# EAGLE design Bike_Seat_Light (EAGLE 7.2.0)
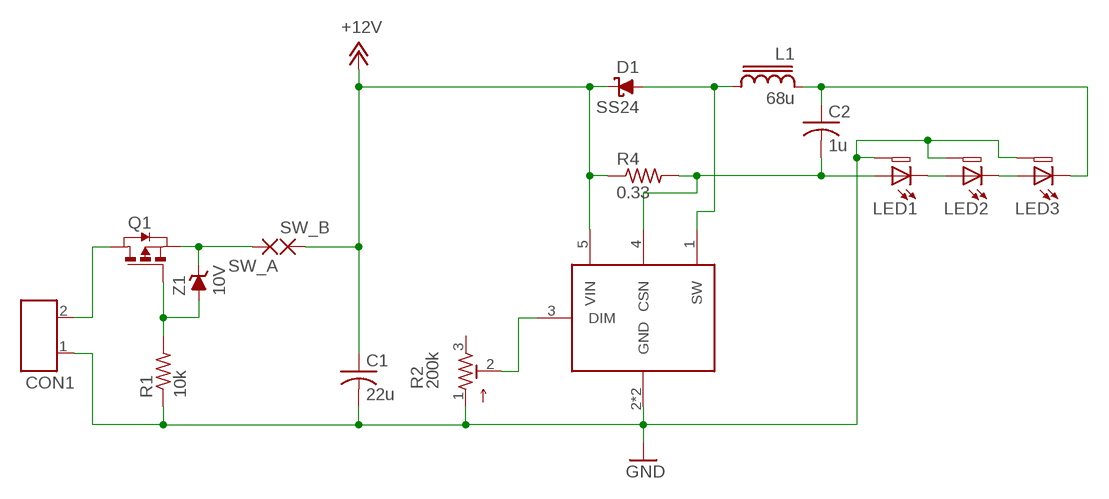
[diagram p0: schematic, sheet 1]

## Parts
C1  22u  C-USC1210K  [C1210K]
C2  1u  C-USC0805K  [C0805K]
CON1  KF128H  [KF128H]
D1  SS24  SCHOTTKYSCHOTTKY-DO214AC  [DO214AC]
IC1  PT4115  [SOT-89-5]
L1  68u  CDRH127/LD  [CDRH127/LD]
LED1  POWER_LED  [POWER_LED]
LED2  POWER_LED  [POWER_LED]
LED3  POWER_LED  [POWER_LED]
Q1  PMOSSOT23  [SOT-23]
R1  10k  R-US_R0805  [R0805]
R2  200k  TRIM_US-3306F  [3306F]
R4  0.33  R-US_R2512  [R2512]
SW_A  1,6/0,9  [1,6/0,9]
SW_B  1,6/0,9  [1,6/0,9]
Z1  10V  ZENER  [SOD123]

## Nets
+12V: C1.1 D1.C IC1.5(VIN) R4.1 SW_B.1(P)
GND: C1.2 CON1.1 IC1.2(GND) IC1.EX(GND) LED1.T LED2.T LED3.T R1.1 R2.1
N$1: C2.2 IC1.4(CSN) LED1.1(A) R4.2
N$2: IC1.3(DIM) R2.2
N$3: Q1.2(S) SW_A.1(P) Z1.C
N$4: D1.A IC1.1(SW) L1.2
N$6: LED1.2(C) LED2.1(A)
N$7: LED2.2(C) LED3.1(A)
N$8: Q1.3(G) R1.2 Z1.A
N$10: C2.1 L1.1 LED3.2(C)
N$17: CON1.2 Q1.1(D)
Unconnected: R2.3

## Library data of the parts
C1 C2 = resistor:C-US: CAPACITOR, American symbol
CON1 = Connector:KF128H
D1 = diode:SCHOTTKY
IC1 = IC:PT4115
L1 = Inductor:CDRH127/LD
LED1-LED3 = LED:POWER_LED
Q1 = zetex:PMOSSOT23: MOS FET; OC_FARNELL: unknown; OC_NEWARK: unknown
R1 R4 = resistor:R-US_: RESISTOR, American symbol
R2 = pot:TRIM_US-: POTENTIOMETER
SW_A SW_B = wirepad:1,6/0,9: THROUGH-HOLE PAD
Z1 = diode:ZENER

## Board
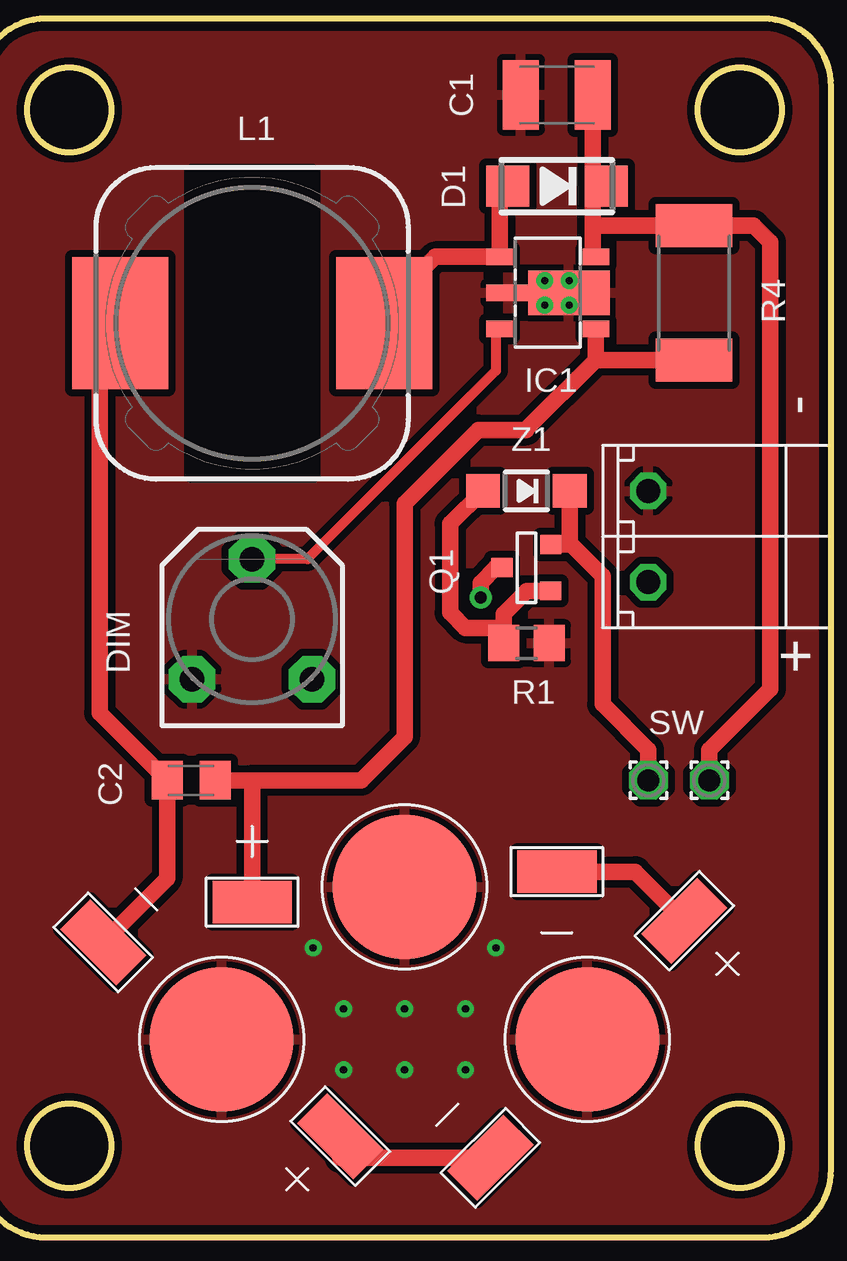
[diagram p1: board, top side]
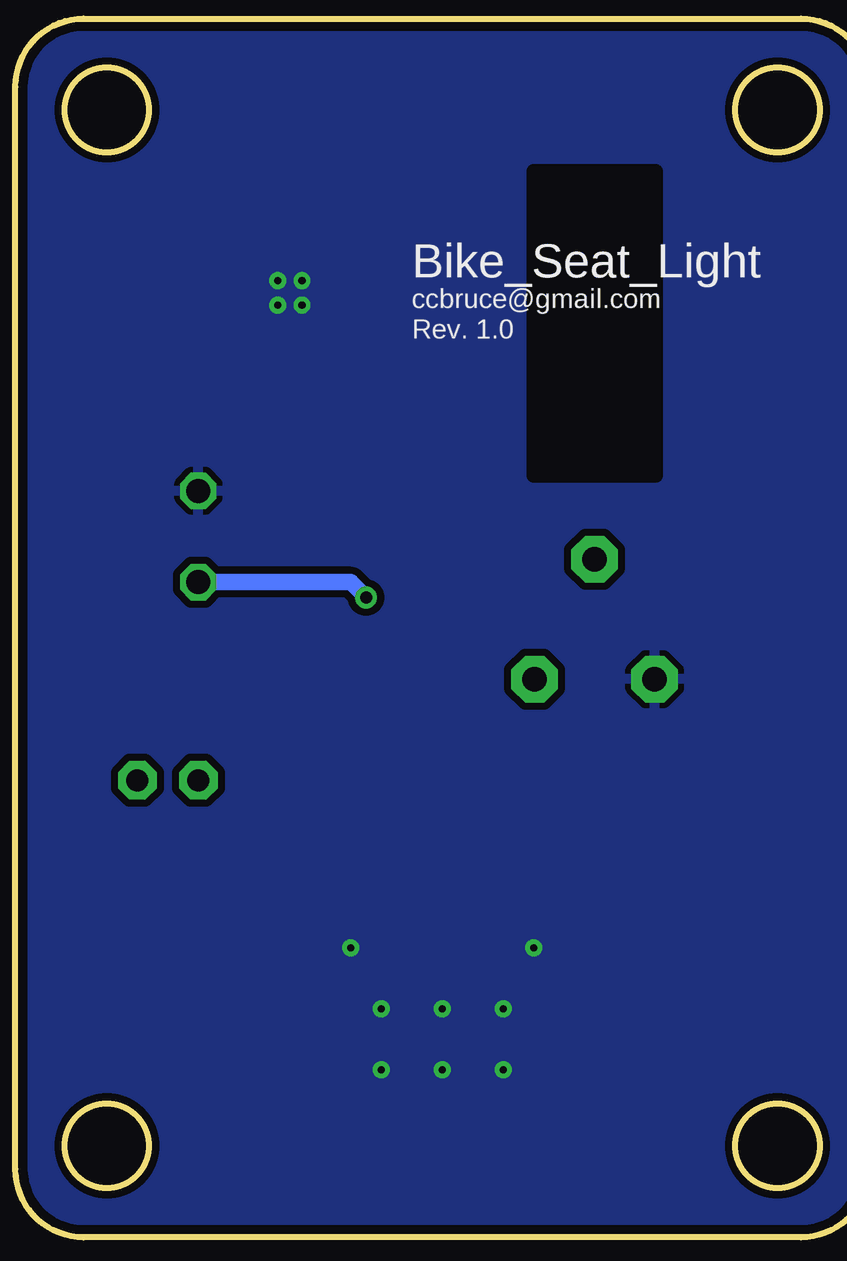
[diagram p2: board, bottom side, seen from below]

No outline drawn. Coordinates in mm, seen from the top.
Copper layers (1*16): Top 0.035mm / dielectric 1.5mm / Bottom 0.035mm
Design rules "default *": minimum track width 10mil, minimum drill 24mil, track to track 8mil, track to pad 8mil, pad to pad 8mil, via to via 8mil, smd to smd 8mil, copper to edge 40mil, drill to drill 8mil, minimum pad ring 10mil, minimum via ring 8mil, stop-mask expansion 4mil, vias tented up to drill 0.6mm, thermal gap 10mil
tRestrict: area 0.8,40.2 to 4.3,43.7; area 28.7,40.2 to 32.2,43.7; area 28.7,-3 to 32.2,0.5; area 0.8,-3 to 4.3,0.5; area 7.6,26.7 to 12.7,39.4; 8 lines
bRestrict: area 0.8,40.2 to 4.3,43.7; area 28.7,-3 to 32.2,0.5; area 0.8,-3 to 4.3,0.5; area 28.7,40.2 to 32.2,43.7; area 7.6,26.7 to 12.7,39.4; 8 lines
Milling: area 28.7,40.2 to 32.2,43.7; area 0.8,40.2 to 4.3,43.7; area 0.8,-3 to 4.3,0.5; area 28.7,-3 to 32.2,0.5; 8 lines

### Footprints (pad centres in the part's own frame; a part is rotated, then mirrored left to right if it is on the bottom)
C1210K = smd 1.5 x 2.9: 1 -1.5,0; 2 1.5,0
C0805K = smd 1.3 x 1.6: 1 -1,0; 2 1,0
KF128H = drill 1 octagon: 1 -1.905,0; 2 1.905,0
DO214AC = smd 1.8 x 1.7: A 2.05,0; C -2.05,0
SOT-89-5 = smd 0.7 x 1.1: 1 -1.5,-2.385; 3 1.5,-2.385; 4 1.5,1.62; 5 -1.5,1.62 | smd 0.7 x 1.8: 2 0,-2.035 | smd 1.85 x 3.4: EX 0,0.5
CDRH127/LD = smd 4 x 5.5: 1 -5.5,0; 2 5.5,0
POWER_LED = smd 3.302 x 1.778: 1 -6.35,-0.635; 2 6.35,0.635 | smd 6 x 6: T 0,0
SOT-23 = smd 0.787 x 0.889: 1 0.025,-1.016; 2 -0.94,1.016; 3 0.991,1.016
R0805 = smd 1.3 x 1.5: 1 -0.95,0; 2 0.95,0
3306F = drill 1.016 pad 1.93 octagon: 1 -2.5,-1.5; 2 0,3.5; 3 2.5,-1.5
R2512 = smd 1.8 x 3.2: 1 -2.8,0; 2 2.8,0
1,6/0,9 = drill 0.914 pad 1.6 octagon: 1 0,0
SOD123 = smd 1.4 x 1.4: A 1.805,0; C -1.805,0

### Placement (x,y rotation side)
C1  22.86,42.55 180 top
C2  7.62,13.97 0 top
CON1  26.67,24.13 270 top
D1  22.86,38.73 180 top
IC1  22.86,34.29 270 top
L1  10.16,33.02 0 top
LED1  16.51,9.53 0 top
LED2  24.13,3.17 225 top
LED3  8.89,3.17 135 top
Q1  21.59,22.86 270 top
R1  21.59,19.68 180 top
R2  10.16,19.68 0 top
R4  28.57,34.29 270 top
SW_A  26.67,13.97 0 top
SW_B  29.21,13.97 0 top
Z1  21.59,26.04 180 top

### Tracks (layer width: path | path; a pad name or v marks a point on that pad's centre or on a via)
+12V
  Top 0.686: C1.1 24.36,38.73 | 24.36,38.73 D1.C | IC1.5 24.36,35.79 24.36,37.09 | 24.36,37.09 R4.1 31.06,37.09 31.75,36.4 31.75,17.78 29.21,15.24 SW_B.1 | 24.36,37.09 24.36,38.73
GND  (via drill 0.3)
  other vias: 22.35,34.8 22.35,33.78 23.37,34.8 23.37,33.78 19.05,4.45 19.05,1.91 16.51,1.91 12.7,6.99 20.32,6.99 16.51,4.45 13.97,4.45 13.97,1.91
  pour Top (isolate 0.305, rank 6): -2.54,46.99 35.56,46.99 35.56,-6.35 -2.54,-6.35
  pour Bottom (isolate 0.305, rank 6): -2.54,46.99 35.56,46.99 35.56,-6.35 -2.54,-6.35
N$1
  Top 0.686: R4.2 24.48,31.49 | 24.48,31.49 IC1.4 | 10.16,13.97 14.71,13.97 16.51,15.77 16.51,25.51 19.58,28.57 21.59,28.57 21.59,28.6 24.48,31.49 | LED1.1 10.16,13.97 | C2.2 10.16,13.97
N$2
  Top 0.406: IC1.3 20.32,32.79 20.32,31.04 12.46,23.18 R2.2
N$3
  Top 0.686: Z1.C 23.39,23.8 Q1.2 23.46,23.8 24.77,22.49 24.77,17.14 26.67,15.24 SW_A.1
N$4
  Top 0.686: D1.A 20.48,38.73 IC1.1 17.79,35.79 15.66,33.66 L1.2
N$6
  Top 0.686: LED1.2 26.12,10.16 LED2.1
N$7
  Top 0.686: LED3.1 13.83,-1.76 LED2.2
N$8
  Top 0.686: Z1.A 18.41,24.66 18.41,20.95 19.05,20.32 20.64,20.32 | Q1.3 21.61,21.87 20.64,20.9 20.64,20.32 | 20.64,20.32 R1.2
N$10
  Top 0.686: LED3.2 6.62,9.88 C2.1 3.81,16.78 3.81,33.02 L1.1
N$17  (via drill 0.5)
  Top 0.686: 20.57,22.86 Q1.1 20.32,22.84 19.68,22.2 v19.68,21.59
  Bottom 0.686: v19.68,21.59 20.32,22.23 CON1.2

### Text on the board
tPlace: - | + | SW
tNames: DIM
bNames: Bike_Seat_Light | ccbruce@gmail.com | Rev. 1.0